# Altium project time-delay-relay.PrjPcb
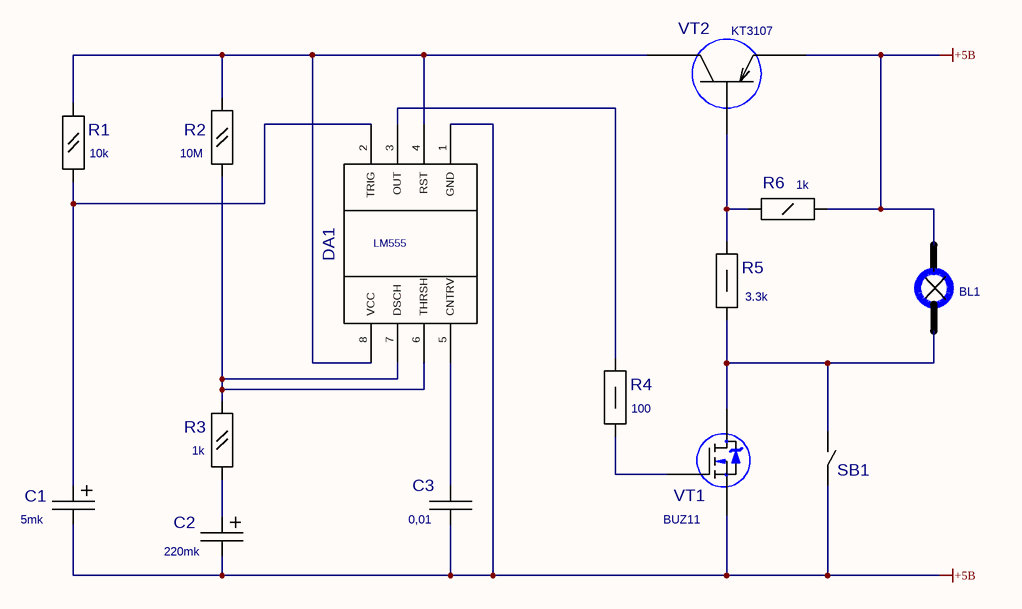
[diagram p0: Sheet1.SCHDOC]
1 sheet, 14 parts. Net scope: global (net labels, ports and power ports of the same name join across sheets).

## Sheet Sheet1.SCHDOC
size 297 x 209 mm; SheetNumber: 1; SheetTotal: 1; DocumentName: Sheet1.SCHDOC

### Parts
BL1  СМН6.3-20-2  [HL_MINI]  (value not drawn)
C1  value 5mk  [CE6032_C]  (hidden comment: CE6032-C)
C2  value 220mk  [CE6032_C]  (hidden comment: CE6032-C)
C3  value 0,01  [CC2220]  (hidden comment: CC2220)
DA1  LM555CM  [SO-8]  (value not drawn)
R1  value 10k  [C2-33H-0.125W]  (hidden comment: C2-33H-0.125W_OLD_UGO)
R2  value 10M  [C2-33H-0.125W]  (hidden comment: C2-33H-0.125W_OLD_UGO)
R3  value 1k  [C2-33H-0.125W]  (hidden comment: C2-33H-0.125W_OLD_UGO)
R4  value 100  [C2-33H-0.5W_15MM]  (hidden comment: C2-33H-0.5W_OLD_UGO)
R5  value 3.3k  [C2-33H-0.5W_15MM]  (hidden comment: C2-33H-0.5W_OLD_UGO)
R6  value 1k  [C2-33H-0.25W]  (hidden comment: C2-33H-0.25W_OLD_UGO)
SB1  8AS9M2RE  [8AS9M2RE]  (value not drawn)
VT1  value BUZ11  [D2PAK]  (hidden comment: 2П771А91)
VT2  value KT3107  [KT26-1 (2002)]  (hidden comment: KT3107 (2002))

### Nets
+5B: BL1.2 C1.2 C2.2 C3.2 DA1.1(GND) R6.2 SB1.2 VT1.3 VT2.3(E)
NetBL1_1: BL1.1 R5.1 SB1.1 VT1.2
NetC1_1: C1.1 DA1.2(TRIG) R1.1
NetC2_1: C2.1 R3.1
NetC3_1: C3.1 DA1.5(CNTRV)
NetDA1_3: DA1.3(OUT) R4.2
NetDA1_4: DA1.4(RST) DA1.8(VCC) R1.2 R2.2 VT2.1(K)
NetDA1_6: DA1.6(THRSH) DA1.7(DSCH) R2.1 R3.2
NetR4_1: R4.1 VT1.1
NetR5_2: R5.2 R6.1 VT2.2(B)

### Notes on the sheet
- (in symbol LM555CM) LM555

### Library data of the parts
R1-R3 = C2-33H-0.125W_OLD_UGO: Autor: pcbdesigner.ru
R4 R5 = C2-33H-0.5W_OLD_UGO: Autor: pcbdesigner.ru
R6 = C2-33H-0.25W_OLD_UGO: Autor: pcbdesigner.ru
DA1 = LM555CM: Value: *
SB1 = 8AS9M2RE: Value: *; Author: pcbdesigner.ru